# Altium schematic sheet Protect.SchDoc
size A3; SheetNumber: 4; SheetTotal: 7
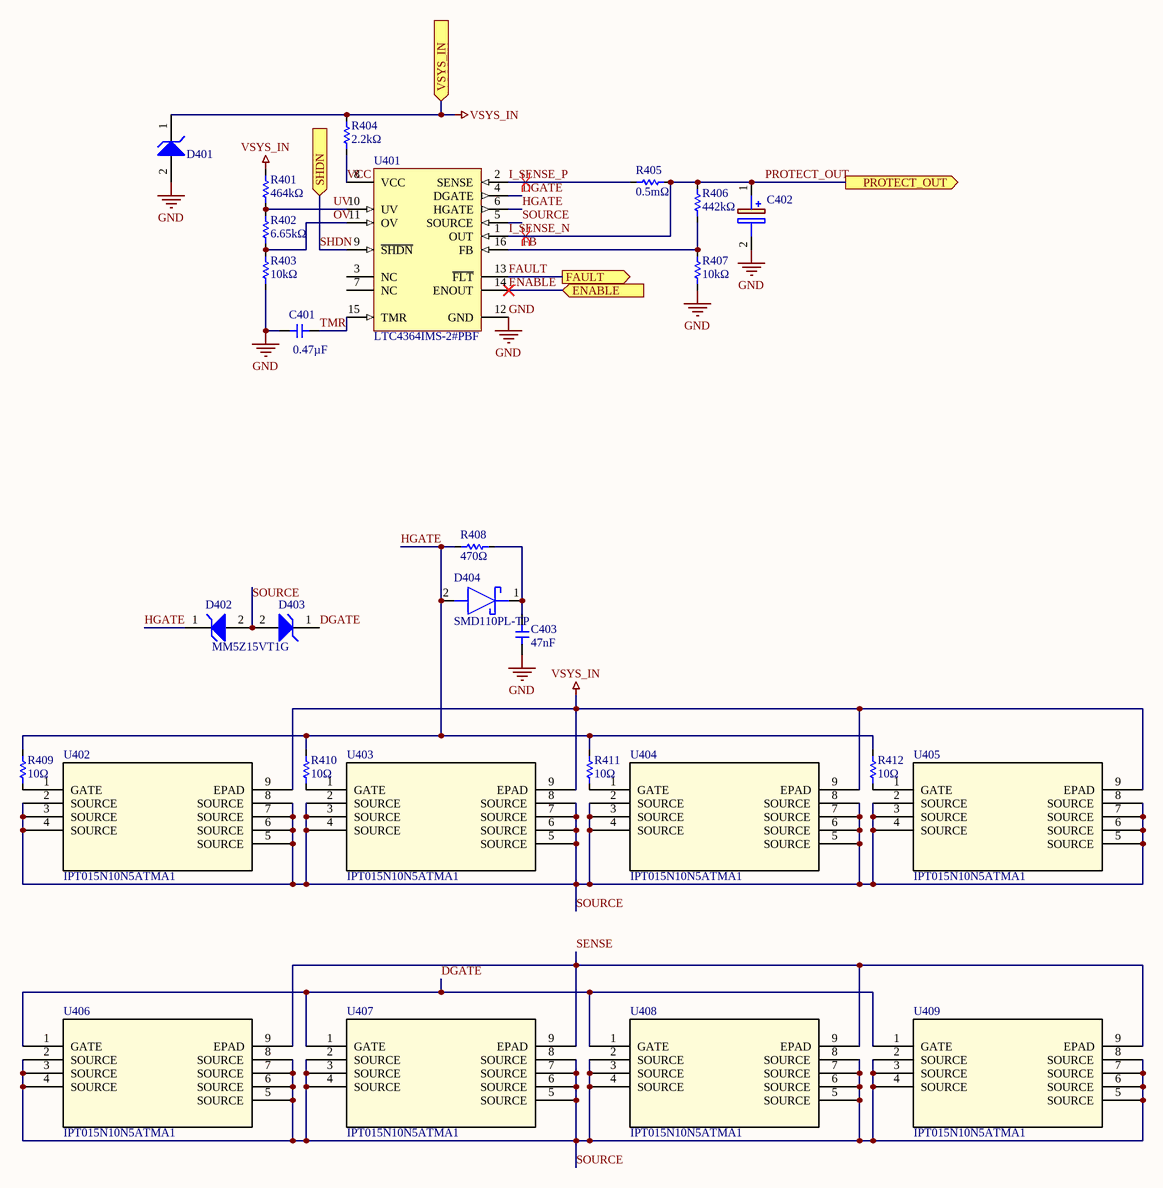
[diagram p0: Protect.SchDoc]

## Parts
C401  Capacitance: 0.47µF  [1210]  (hidden comment: non-polar_Capacitor)
C402  B41858C9477M000  [CAPPRD750W90D1800H3700]  (value not drawn)
C403  Capacitance: 47nF  [1210]  (hidden comment: non-polar_Capacitor)
D401  1SMB5945BT3G  [ONSC-SMB-2-403A-03_H_V]  (value not drawn)
D402  MM5Z15VT1G  [ONSC-SOD-523-2-502-01_V]
D403  MM5Z15VT1G  [ONSC-SOD-523-2-502-01_V]  (value not drawn)
D404  SMD110PL-TP  [SODFL3616X135N]
R401  464kΩ  [SMD_0603]
R402  6.65kΩ  [SMD_0603]
R403  10kΩ  [SMD_0603]
R404  2.2kΩ  [SMD_2512]
R405  0.5mΩ  [SMD_2512]
R406  442kΩ  [SMD_0603]
R407  10kΩ  [SMD_0603]
R408  470Ω  [SMD_0603]
R409  10Ω  [SMD_0603]
R410  10Ω  [SMD_0603]
R411  10Ω  [SMD_0603]
R412  10Ω  [SMD_0603]
U401  LTC4364IMS-2#PBF  [LT-MS-16_M]
U402  IPT015N10N5ATMA1  [PG-HSOF-8-1_INF]
U403  IPT015N10N5ATMA1  [PG-HSOF-8-1_INF]
U404  IPT015N10N5ATMA1  [PG-HSOF-8-1_INF]
U405  IPT015N10N5ATMA1  [PG-HSOF-8-1_INF]
U406  IPT015N10N5ATMA1  [PG-HSOF-8-1_INF]
U407  IPT015N10N5ATMA1  [PG-HSOF-8-1_INF]
U408  IPT015N10N5ATMA1  [PG-HSOF-8-1_INF]
U409  IPT015N10N5ATMA1  [PG-HSOF-8-1_INF]

## Ports
ENABLE (in), FAULT (out), PROTECT_OUT (out), SHDN (in), VSYS_IN (in, see 12V_Buck_Converter[7A])

## Nets
GND: C401.1 C402.2(-) C403.1 D401.2(A) R403.2 R407.2 U401.12(GND)
VSYS_IN: D401.1(K) R401.1 R404.1 U402.9(EPAD) U403.9(EPAD) U404.9(EPAD) U405.9(EPAD) ; port VSYS_IN
DGATE: D403.1(K) U401.4(DGATE) U406.1(GATE) U407.1(GATE) U408.1(GATE) U409.1(GATE)
ENABLE: U401.14(ENOUT) ; port ENABLE
FAULT: U401.13(~{FLT}) ; port FAULT
FB: R406.2 R407.1 U401.16(FB)
HGATE: D402.1(K) D404.2(A) R408.1 R409.1 R410.1 R411.1 R412.1 U401.6(HGATE)
I_SENSE_N: C402.1(+) R405.2 R406.1 U401.1(OUT) ; port PROTECT_OUT  [also labelled PROTECT_OUT]
I_SENSE_P: R405.1 U401.2(SENSE)
OV: R402.2 R403.1 U401.11(OV)
SENSE: U406.9(EPAD) U407.9(EPAD) U408.9(EPAD) U409.9(EPAD)
SHDN: U401.9(~{SHDN}) ; port SHDN
SOURCE: D402.2(A) D403.2(A) U401.5(SOURCE) U402.2(SOURCE) U402.3(SOURCE) U402.4(SOURCE) U402.5(SOURCE) U402.6(SOURCE) U402.7(SOURCE) U402.8(SOURCE) U403.2(SOURCE) U403.3(SOURCE) U403.4(SOURCE) U403.5(SOURCE) U403.6(SOURCE) U403.7(SOURCE) U403.8(SOURCE) U404.2(SOURCE) U404.3(SOURCE) U404.4(SOURCE) U404.5(SOURCE) U404.6(SOURCE) U404.7(SOURCE) U404.8(SOURCE) U405.2(SOURCE) U405.3(SOURCE) U405.4(SOURCE) U405.5(SOURCE) U405.6(SOURCE) U405.7(SOURCE) U405.8(SOURCE) U406.2(SOURCE) U406.3(SOURCE) U406.4(SOURCE) U406.5(SOURCE) U406.6(SOURCE) U406.7(SOURCE) U406.8(SOURCE) U407.2(SOURCE) U407.3(SOURCE) U407.4(SOURCE) U407.5(SOURCE) U407.6(SOURCE) U407.7(SOURCE) U407.8(SOURCE) U408.2(SOURCE) U408.3(SOURCE) U408.4(SOURCE) U408.5(SOURCE) U408.6(SOURCE) U408.7(SOURCE) U408.8(SOURCE) U409.2(SOURCE) U409.3(SOURCE) U409.4(SOURCE) U409.5(SOURCE) U409.6(SOURCE) U409.7(SOURCE) U409.8(SOURCE)
TMR: C401.2 U401.15(TMR)
UV: R401.2 R402.1 U401.10(UV)
VCC: R404.2 U401.8(VCC)
NetC403_2: C403.2 D404.1(K) R408.2
NetR409_2: R409.2 U402.1(GATE)
NetR410_2: R410.2 U403.1(GATE)
NetR411_2: R411.2 U404.1(GATE)
NetR412_2: R412.2 U405.1(GATE)

Not connected (* = marked no-connect by the designer): U401 3(NC) 7(NC)

## Layout directives
differential pair: I_SENSE_N, I_SENSE_P

## Library data of the parts
C401 C403 = CMP-024-000020-15: SMD type ceramic capacitor; Voltage: 50V; Design Item ID: Capacitor; Source: robit_passive.SchLib
C402 = B41858C9477M000: Capacitor Polarised; Manufacturer_Name: TDK; Datasheet Link: https://product.tdk.com/system/files/dam/doc/product/capacitor/aluminum-electrolytic/single-ended/data_sheet/20/30/db/aec/b41858.pdf; Height: 37mm; Manufacturer_Part_Number: B41858C9477M000; Mouser Part Number: 871-B41858C9477M; Mouser Price/Stock: https://www.mouser.co.uk/ProductDetail/EPCOS-TDK/B41858C9477M000?qs=nadT%2FcWsIvCTpIhXZMST%2FQ%3D%3D
D401 = CMP-1060-00175-1: 3 W Zener Voltage Regulator, 2-Pin SMB, Pb-Free, Tape and Reel; Manufacturer: On Semiconductor; VZ Typ (V): 68; ComponentLink3URL: http://www.onsemi.com/pub_link/Collateral/1SMB5913BT3-D.PDF; PackageReference: SMB-2-403A-03_H; PackageDescription: 2-Pin Small Molded Package, J-Bend Lead, Body 4.33 x 3.625 mm; PackageVersion: Rev. H, 05/2011; PartNumber: 1SMB5945BT3G; DatasheetVersion: Rev. 8; ComponentLink1Description: Manufacturer URL; ComponentLink1URL: http://www.onsemi.com/; RoHS: Pb-Free; ComponentLink2Description: Datasheet; Packing: Tape and Reel; ComponentLink2URL: http://www.onsemi.com/pub_link/Collateral/1SMB5913BT3-D.PDF; ComponentLink3Description: Package Specification; Mounting Technology: Surface Mount
D402 D403 = CMP-1060-00793-1: Zener Voltage Regulator, 500 mW, 2-Pin SOD-523, Pb-Free, Tape and Reel; Manufacturer: On Semiconductor; VZ Typ (V): 15; P Max (W): 0.5; PackageVersion: Rev. E, 09/2010; PartNumber: MM5Z15VT1G; ComponentLink2URL: http://www.onsemi.cn/pub_link/Collateral/MM5Z2V4T1-D.PDF; ComponentLink2Description: Datasheet; ComponentLink1Description: Manufacturer URL; PackageReference: SOD-523-2-502-01; ComponentLink3URL: http://www.onsemi.com/pub_link/Collateral/502-01.PDF; PackageDescription: 2-Pin SOD, Body 1.2 x 0.8 mm; ComponentLink3Description: Package Specification; RoHS: Pb-Free; ComponentLink1URL: http://www.onsemi.com/; Mounting Technology: Surface Mount; Packing: Tape and Reel; DatasheetVersion: Rev. 10
D404 = SMD110PL-TP: Schottky Diode; Manufacturer_Name: MCC; Datasheet Link: https://www.mccsemi.com/pdf/Products/SMD15PL-SMD1200PL(SOD-123FL).pdf; Height: 1.35mm; Manufacturer_Part_Number: SMD110PL-TP; Mouser Part Number: 833-SMD110PL-TP; Mouser Price/Stock: https://www.mouser.co.uk/ProductDetail/Micro-Commercial-Components-MCC/SMD110PL-TP?qs=xjxbgUsuSIBtRX%252BtbqnRwQ%3D%3D; Arrow Part Number: SMD110PL-TP; Arrow Price/Stock: https://www.arrow.com/en/products/smd110pl-tp/micro-commercial-components?utm_currency=USD&region=europe
R401-R407 R409-R412 = Resistor
R408 = Resistor: 0.1W, 0603
U401 = CMP-0474-00539-1: Surge Stopper with Ideal Diode, 4 to 80 V Vin, 16-pin SOP (MS-16), -40 to 85 degC, Pb-Free; Manufacturer: Linear Technology; Fast Comparator: no; Circuit Breaker Threshold: 50 mV; Circuit Breakers(#): 1; Active Limiting: yes; Vin Range: 4 to 80 V; Circuit Breaker Accuracy(%): 10; Extended Temp: C, I, H; ComponentLink1Description: Manufacturer URL; PackageReference: MS16; Mounting Technology: Surface Mount; RoHS: TRUE; PackageDescription: 16-Pin Plastic MSOP, Body 4.04 x 3.00 mm, Pitch 0.50 mm; ComponentLink3Description: Package Specification; PartNumber: LTC4364IMS-2#PBF; Power Good: no; ComponentLink2Description: Datasheet; ComponentLink2URL: http://cds.linear.com/docs/en/datasheet/436412f.pdf; ComponentLink1URL: http://www.linear.com/; ComponentLink3URL: http://cds.linear.com/docs/en/packaging/05081669_A_MS16.pdf; PackageVersion: Rev. Ã˜, 06/2010
U402-U409 = IPT015N10N5ATMA1: Infineonâ€™s OptiMOSâ„¢ power MOSFET in TO-Leadless package is optimized for high current applications up to 300 A, such as forklifts, light electric vehicles (LEV), power tools, point-of-loads (POL), telecom and e-fuses. Furthermore, the 60 percent smaller package size enables a very compact design. Compared to DÂ²PAK 7-pin, TO-Leadless shows a substantial reduction in footprint of 30 percent. The 50 percent reduced height offers a significant advantage in narrow applications such as rack or blade servers.; Copyright: Copyright (C) 2025 Ultra Librarian. All rights reserved.; Manufacturer_Name: Infineon; Manufacturer_Part_Number: IPT015N10N5ATMA1; RefDes: RefDes; Type: Type